# Altium project Capstone PCB.PrjPcb
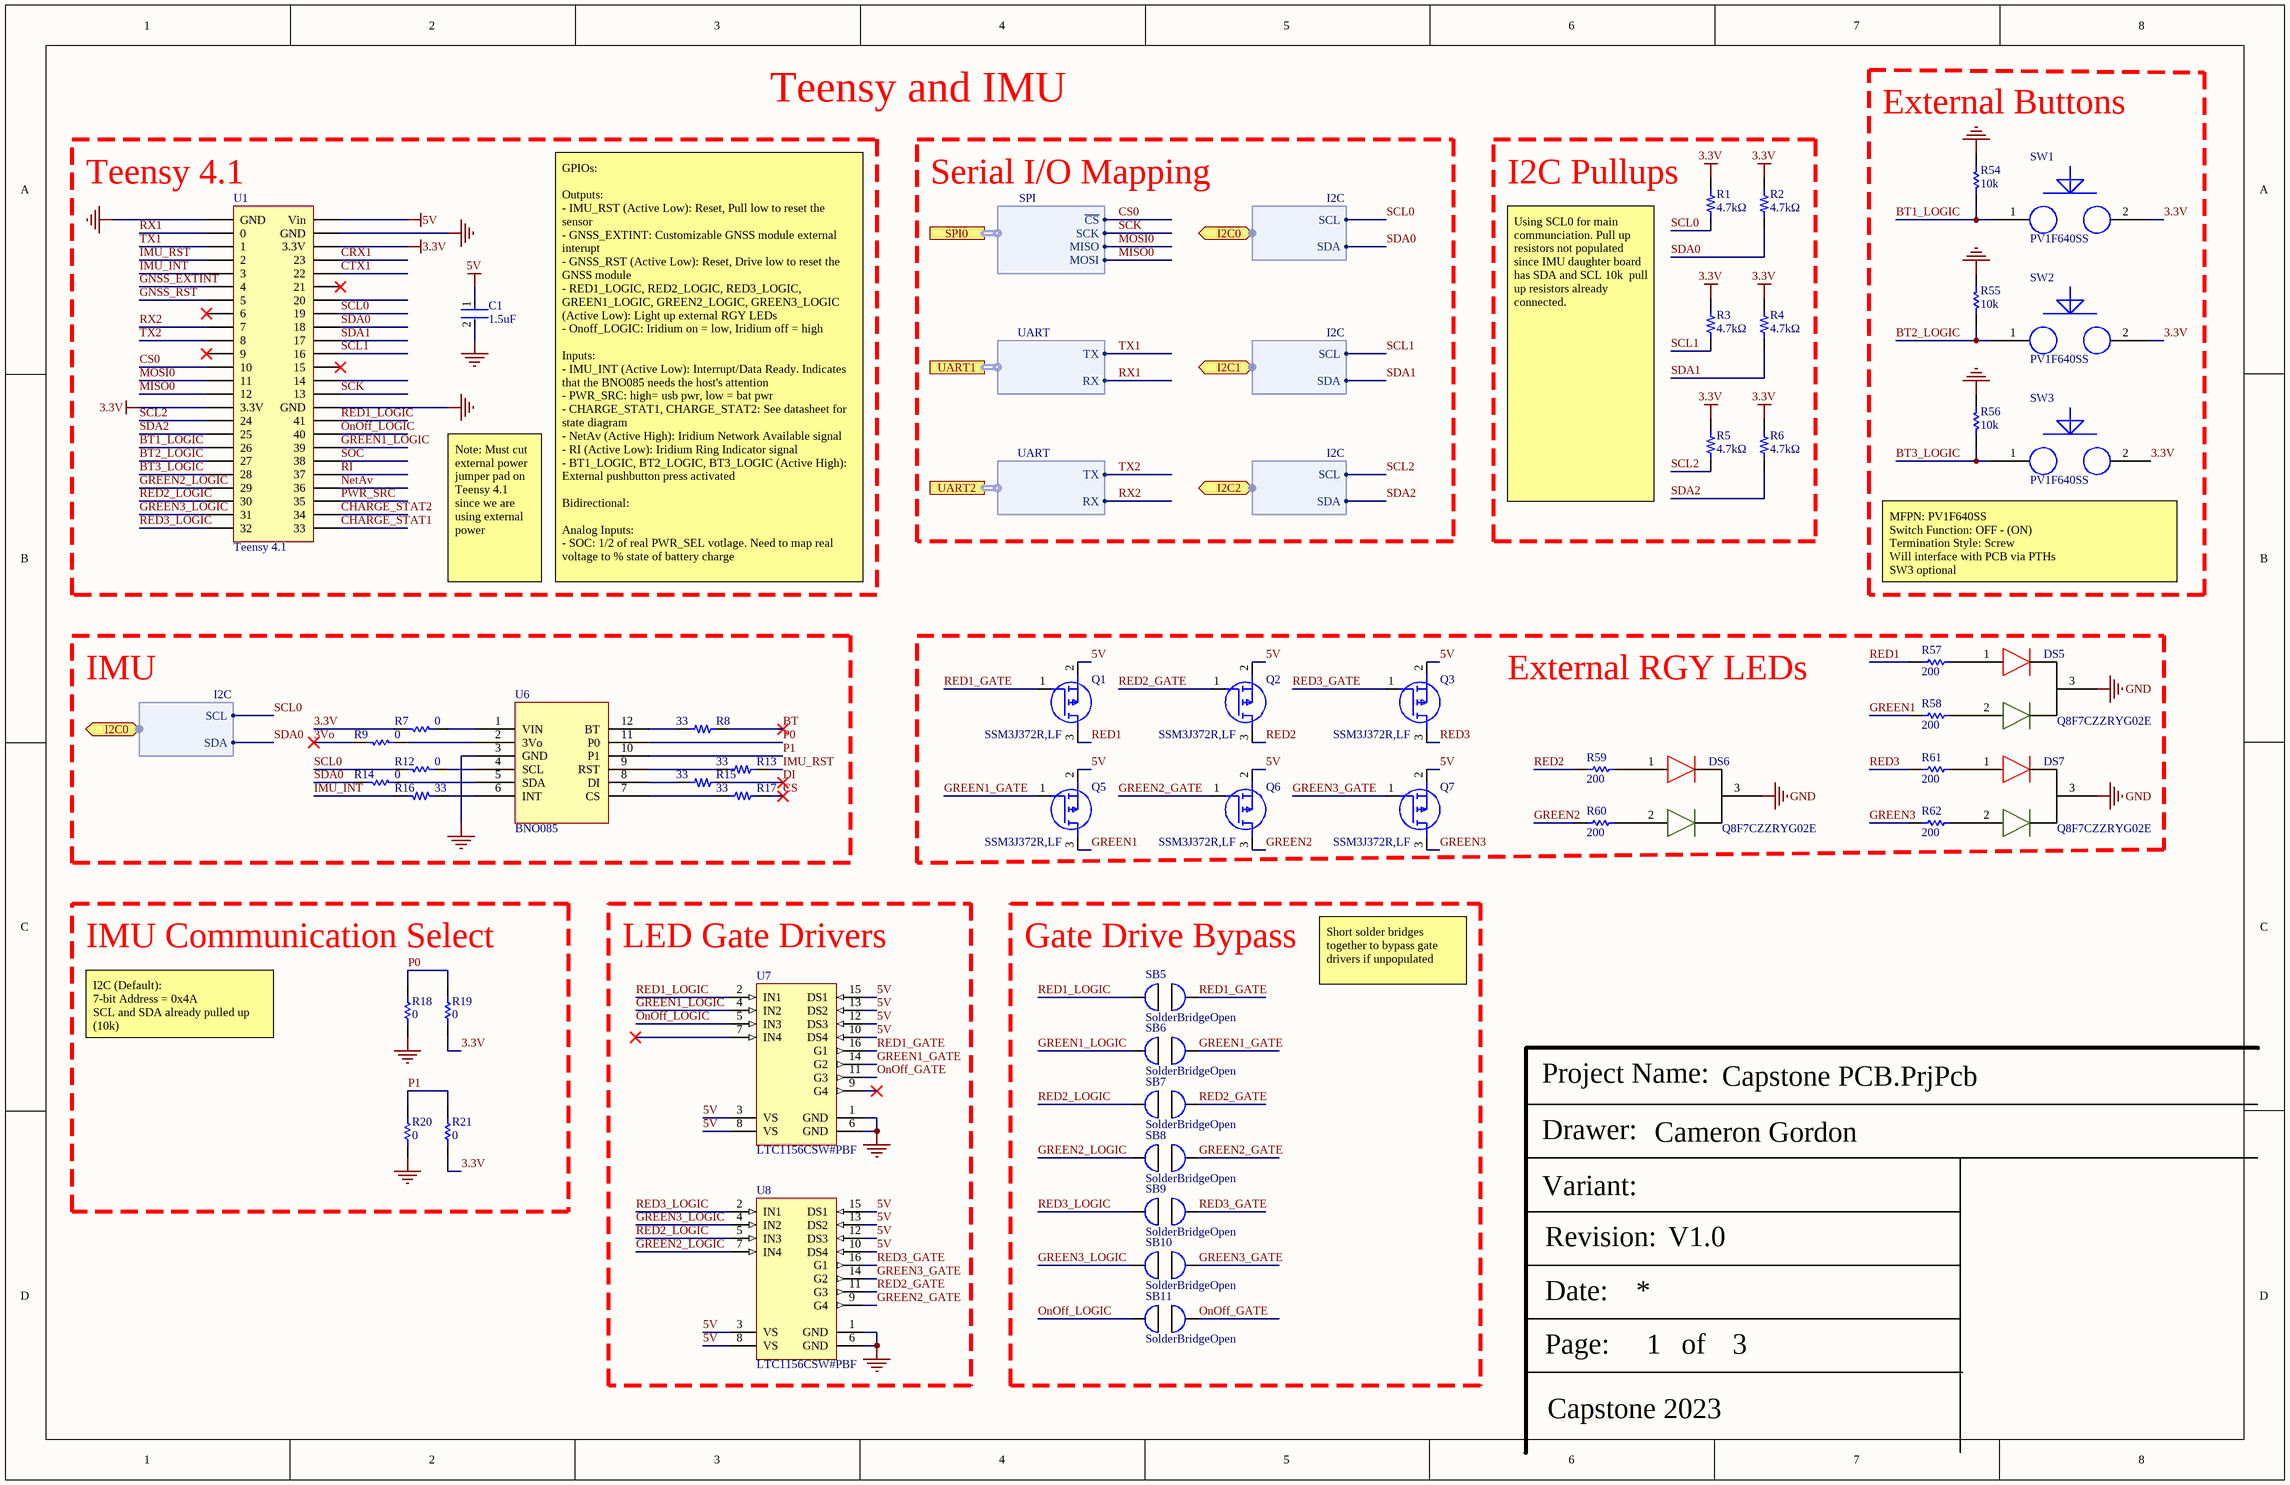
[diagram p0: Teensy and ICs.SchDoc]
ProjectDrawer: Cameron Gordon; ProjectRevision: V1.0
3 sheets, 135 parts. Net scope: global (net labels, ports and power ports of the same name join across sheets).
Board file: Capstone PCB.PcbDoc
Sheets:
  Teensy and ICs.SchDoc
  Power Management.SchDoc
  Communication.SchDoc

## Sheet Teensy and ICs.SchDoc: NER A Size Template
size Tabloid; ApprovedBy: WS; DrawnBy: Cameron Gordon; Address4: X.X.X; Revision: 1; SheetNumber: 1; SheetTotal: 3

### Parts
C1  Capacitance: 1.5uF  [FP-C2012-125-0_2-MFG]  (hidden comment: C2012X7R1E155K125AC)
DS5  Q8F7CZZRYG02E  [Q8F7CZZRYG02E]
DS6  Q8F7CZZRYG02E  [Q8F7CZZRYG02E]
DS7  Q8F7CZZRYG02E  [Q8F7CZZRYG02E]
Q1  SSM3J372R,LF  [SSM3J372RLF]
Q2  SSM3J372R,LF  [SSM3J372RLF]
Q3  SSM3J372R,LF  [SSM3J372RLF]
Q5  SSM3J372R,LF  [SSM3J372RLF]
Q6  SSM3J372R,LF  [SSM3J372RLF]
Q7  SSM3J372R,LF  [SSM3J372RLF]
R1  Resistance: 4.7kΩ  [0603 Resistor]  (hidden comment: ERJ-3GEYJ472V)
R2  Resistance: 4.7kΩ  [0603 Resistor]  (hidden comment: ERJ-3GEYJ472V)
R3  Resistance: 4.7kΩ  [0603 Resistor]  (hidden comment: ERJ-3GEYJ472V)
R4  Resistance: 4.7kΩ  [0603 Resistor]  (hidden comment: ERJ-3GEYJ472V)
R5  Resistance: 4.7kΩ  [0603 Resistor]  (hidden comment: ERJ-3GEYJ472V)
R6  Resistance: 4.7kΩ  [0603 Resistor]  (hidden comment: ERJ-3GEYJ472V)
R7  Resistance: 0  [RESC1608X55X25ML10T15]  (hidden comment: RC0603JR-070RL)
R8  Resistance: 33  [0603 Resistor]  (hidden comment: CRGCQ0603J33R)
R9  Resistance: 0  [RESC1608X55X25ML10T15]  (hidden comment: RC0603JR-070RL)
R12  Resistance: 0  [RESC1608X55X25ML10T15]  (hidden comment: RC0603JR-070RL)
R13  Resistance: 33  [0603 Resistor]  (hidden comment: CRGCQ0603J33R)
R14  Resistance: 0  [RESC1608X55X25ML10T15]  (hidden comment: RC0603JR-070RL)
R15  Resistance: 33  [0603 Resistor]  (hidden comment: CRGCQ0603J33R)
R16  Resistance: 33  [0603 Resistor]  (hidden comment: CRGCQ0603J33R)
R17  Resistance: 33  [0603 Resistor]  (hidden comment: CRGCQ0603J33R)
R18  Resistance: 0  [RESC1608X55X25ML10T15]  (hidden comment: RC0603JR-070RL)
R19  Resistance: 0  [RESC1608X55X25ML10T15]  (hidden comment: RC0603JR-070RL)
R20  Resistance: 0  [RESC1608X55X25ML10T15]  (hidden comment: RC0603JR-070RL)
R21  Resistance: 0  [RESC1608X55X25ML10T15]  (hidden comment: RC0603JR-070RL)
R54  Resistance: 10k  [RESC1609X55X30LL15T15]  (hidden comment: ERJ3EKF1002V)
R55  Resistance: 10k  [RESC1609X55X30LL15T15]  (hidden comment: ERJ3EKF1002V)
R56  Resistance: 10k  [RESC1609X55X30LL15T15]  (hidden comment: ERJ3EKF1002V)
R57  value 200  [RESC2013X60X35ML10T20]  (hidden comment: RC0805JR-07200RL)
R58  value 200  [RESC2013X60X35ML10T20]  (hidden comment: RC0805JR-07200RL)
R59  value 200  [RESC2013X60X35ML10T20]  (hidden comment: RC0805JR-07200RL)
R60  value 200  [RESC2013X60X35ML10T20]  (hidden comment: RC0805JR-07200RL)
R61  value 200  [RESC2013X60X35ML10T20]  (hidden comment: RC0805JR-07200RL)
R62  value 200  [RESC2013X60X35ML10T20]  (hidden comment: RC0805JR-07200RL)
SB5  SolderBridgeOpen  [SOLDERBRIDGEOPEN]
SB6  SolderBridgeOpen  [SOLDERBRIDGEOPEN]
SB7  SolderBridgeOpen  [SOLDERBRIDGEOPEN]
SB8  SolderBridgeOpen  [SOLDERBRIDGEOPEN]
SB9  SolderBridgeOpen  [SOLDERBRIDGEOPEN]
SB10  SolderBridgeOpen  [SOLDERBRIDGEOPEN]
SB11  SolderBridgeOpen  [SOLDERBRIDGEOPEN]
SW1  PV1F640SS  [PV1F640SS-Footprint-1]
SW2  PV1F640SS  [PV1F640SS-Footprint-1]
SW3  PV1F640SS  [PV1F640SS-Footprint-1]
U1  Teensy 4.1  [Teensy_4.1]
U6  BNO085  [BNO085]
U7  LTC1156CSW#PBF  [LT-SW-16_L]
U8  LTC1156CSW#PBF  [LT-SW-16_L]

### Blocks framed on the sheet
External Buttons: R54-R56 SW1-SW3
Teensy 4.1: C1 U1
I2C Pullups: R1-R6
IMU: R7-R9 R12-R17 U6
External RGY LEDs: DS5-DS7 Q1-Q3 Q5-Q7 R57-R62
IMU Communication Select: R18-R21
LED Gate Drivers: U7 U8
Gate Drive Bypass: SB5-SB11

### Ports
I2C0 (bidir, harness I2C), I2C1 (bidir, harness I2C), I2C2 (bidir, harness I2C), SPI0 (harness SPI), UART1 (harness UART), UART2 (harness UART)

### Harnesses
SPI: MOSI, MISO, ~{CS}, SCK
UART: TX, RX
I2C: SCL, SDA

### Nets
3.3V: R1.2 R2.2 R3.2 R4.2 R5.2 R6.2 R7.1 R19.1 R21.1 SW1.2 SW2.2 SW3.2 U1.15(3.3V) U1.46(3.3V)
5V: C1.1 Q1.2(S) Q2.2(S) Q3.2(S) Q5.2(S) Q6.2(S) Q7.2(S) U1.48(Vin) U7.3(VS) U7.8(VS) U7.10(DS4) U7.12(DS3) U7.13(DS2) U7.15(DS1) U8.3(VS) U8.8(VS) U8.10(DS4) U8.12(DS3) U8.13(DS2) U8.15(DS1)
GND: C1.2 DS5.3 DS6.3 DS7.3 R18.1 R20.1 R54.1 R55.1 R56.1 U1.1(GND) U1.34(GND) U1.47(GND) U6.3(GND) U7.1(GND) U7.6(GND) U8.1(GND) U8.6(GND)
3Vo: R9.1
BT: R8.2
BT1_LOGIC: R54.2 SW1.1 U1.18(26)
BT2_LOGIC: R55.2 SW2.1 U1.19(27)
BT3_LOGIC: R56.2 SW3.1 U1.20(28)
CHARGE_STAT1: U1.25(33)
CHARGE_STAT2: U1.26(34)
CRX1: U1.45(23)
CS: R17.2
CS0: U1.12(10) ; port SPI0.~{CS}
CTX1: U1.44(22)
DI: R15.2
GNSS_EXTINT: U1.6(4)
GNSS_RST: U1.7(5)
GREEN1: Q5.3(D) R58.2
GREEN1_GATE: Q5.1(G) SB6.1 U7.14(G2)
GREEN1_LOGIC: SB6.2 U1.31(39) U7.4(IN2)
GREEN2: Q6.3(D) R60.2
GREEN2_GATE: Q6.1(G) SB8.1 U8.9(G4)
GREEN2_LOGIC: SB8.2 U1.21(29) U8.7(IN4)
GREEN3: Q7.3(D) R62.2
GREEN3_GATE: Q7.1(G) SB10.1 U8.14(G2)
GREEN3_LOGIC: SB10.2 U1.23(31) U8.4(IN2)
IMU_INT: R16.2 U1.5(3)
IMU_RST: R13.2 U1.4(2)
MISO0: U1.14(12) ; port SPI0.MOSI
MOSI0: U1.13(11) ; port SPI0.MISO
NetAv: U1.28(36)
OnOff_GATE: SB11.1 U7.11(G3)
OnOff_LOGIC: SB11.2 U1.32(40) U7.5(IN3)
P0: R18.2 R19.2 U6.11(P0)
P1: R20.2 R21.2 U6.10(P1)
PWR_SRC: U1.27(35)
RED1: Q1.3(D) R57.2
RED1_GATE: Q1.1(G) SB5.1 U7.16(G1)
RED1_LOGIC: SB5.2 U1.33(41) U7.2(IN1)
RED2: Q2.3(D) R59.2
RED2_GATE: Q2.1(G) SB7.1 U8.11(G3)
RED2_LOGIC: SB7.2 U1.22(30) U8.5(IN3)
RED3: Q3.3(D) R61.2
RED3_GATE: Q3.1(G) SB9.1 U8.16(G1)
RED3_LOGIC: SB9.2 U1.24(32) U8.2(IN1)
RI: U1.29(37)
RX1: U1.2(0) ; port UART1.RX
RX2: U1.9(7) ; port UART2.RX
SCK: U1.35(13) ; port SPI0.SCK
SCL0: R1.1 R12.1 U1.41(19) ; port I2C0.SCL
SCL1: R3.1 U1.38(16) ; port I2C1.SCL
SCL2: R5.1 U1.16(24) ; port I2C2.SCL
SDA0: R2.1 R14.1 U1.40(18) ; port I2C0.SDA
SDA1: R4.1 U1.39(17) ; port I2C1.SDA
SDA2: R6.1 U1.17(25) ; port I2C2.SDA
SOC: U1.30(38)
TX1: U1.3(1) ; port UART1.TX
TX2: U1.10(8) ; port UART2.TX
NetDS5_1: DS5.1 R57.1
NetDS5_2: DS5.2 R58.1
NetDS6_1: DS6.1 R59.1
NetDS6_2: DS6.2 R60.1
NetDS7_1: DS7.1 R61.1
NetDS7_2: DS7.2 R62.1
NetR7_2: R7.2 U6.1(VIN)
NetR8_1: R8.1 U6.12(BT)
NetR9_2: R9.2 U6.2(3Vo)
NetR12_2: R12.2 U6.4(SCL)
NetR13_1: R13.1 U6.9(RST)
NetR14_2: R14.2 U6.5(SDA)
NetR15_1: R15.1 U6.8(DI)
NetR16_1: R16.1 U6.6(INT)
NetR17_1: R17.1 U6.7(CS)

Not connected (* = marked no-connect by the designer): U1 8(6)* 11(9)* 36(14) 37(15)* 42(20) 43(21)*; U7 7(IN4)* 9(G4)*

### Notes on the sheet
- Teensy and IMU
- Serial I/O Mapping
- Using SCL0 for main communciation. Pull up resistors not populated since IMU daughter board has SDA and SCL 10k  pull up resistors already connected.
- Note: Must cut external power jumper pad on Teensy 4.1 since we are using external power
- GPIOs:
  Outputs:
  - IMU_RST (Active Low): Reset, Pull low to reset the sensor
  - GNSS_EXTINT: Customizable GNSS module external interupt
  - GNSS_RST (Active Low): Reset, Drive low to reset the GNSS module
  - RED1_LOGIC, RED2_LOGIC, RED3_LOGIC, GREEN1_LOGIC, GREEN2_LOGIC, GREEN3_LOGIC (Active Low): Light up external RGY LEDs
  - Onoff_LOGIC: Iridium on = low, Iridium off = high
  Inputs:
  - IMU_INT (Active Low): Interrupt/Data Ready. Indicates that the BNO085 needs the host's attention
  - PWR_SRC: high= usb pwr, low = bat pwr
  - CHARGE_STAT1, CHARGE_STAT2: See datasheet for state diagram
  - NetAv (Active High): Iridium Network Available signal
  - RI (Active Low): Iridium Ring Indicator signal
  - BT1_LOGIC, BT2_LOGIC, BT3_LOGIC (Active High): External pushbutton press activated
  Bidirectional:
  Analog Inputs:
  - SOC: 1/2 of real PWR_SEL votlage. Need to map real voltage to % state of battery charge
- (near SW3) MFPN: PV1F640SS
  Switch Function: OFF - (ON)
  Termination Style: Screw
  Will interface with PCB via PTHs
  SW3 optional
- I2C (Default):
  7-bit Address = 0x4A
  SCL and SDA already pulled up (10k)
- Short solder bridges together to bypass gate drivers if unpopulated
- Project Name:
- Drawer:
- Variant:
- Revision:
- Date:
- Page:
- of
- Capstone 2023

### Library data of the parts
C1 = CMP-08246-004820-1: Multilayer Ceramic Capacitors 1.5μF ±10% 25V X7R SMD 0805; Case Code (Imperial): 0805; Min Operating Temperature: -55°C; Termination: SMD/SMT; Dielectric Material: Ceramic; Weight: 0.000194oz; Height: 1.25mm; Width: 0.049inch; Dielectric: X7R; Voltage Rating: 25V; Max Operating Temperature: 125°C; Mount: Surface Mount; Tolerance: 10%; Length: 0.079inch; Voltage Rating (DC): 25V; Case Code (Metric): 2012; Resistor Type: Ceramic; Thickness: 0.057inch; RoHS Compliant: Yes; Case/Package: 0805; Lead Free: Lead Free; Package Quantity: 1; Packaging: Tape and Reel
Q1-Q3 Q5-Q7 = SSM3J372R,LF: MOSFET (P-Channel); Manufacturer_Name: Toshiba; Datasheet Link: https://toshiba.semicon-storage.com/ap-en/semiconductor/product/mosfets/detail.SSM3J372R.html; Height: 0.88mm; Manufacturer_Part_Number: SSM3J372R,LF; Mouser Part Number: 757-SSM3J372RLF; Mouser Price/Stock: https://www.mouser.co.uk/ProductDetail/Toshiba/SSM3J372RLF?qs=u16ybLDytRbJaSMlwq9MLA%3D%3D; Arrow Part Number: SSM3J372R,LF; Arrow Price/Stock: https://www.arrow.com/en/products/ssm3j372rlf/toshiba?region=nac
R1-R6 = CMP-001-0036-2: 0603 Resistor, 4.7kΩ, ±5%, 0.1W; Power Rating: 100mW; Tolerance: 5%; Package: 0603
R7 R9 R12 R14 R18-R21 = CMP-2100-03667-1: Chip Resistor, 0 Ohm, +/- 5%, 0.1 W, -55 to 155 degC, 0603 (1608 Metric), RoHS, Tape and Reel; Manufacturer: Yageo; Temperature Coefficient: 200ppm/degreesC; Voltage Rating: 50V; Power Rating: 100mW; Width: 0.8mm; Max Operating Temperature: 155degC; Tolerance: 5%; Package Reference: 0603; Height: 0.45mm; Depth: 0.8mm; Package Description: 2-Pin Surface Mount Device, Body 1.6 x 0.8 mm; Termination: SMD/SMT; Package Quantity: 5000; Case/Package: 0603; Case Code (Imperial): 0603; Radiation Hardening: No; Number of Pins: 2; Length: 1.6mm; Lead Free: LeadFree; Voltage Rating (DC): 50V; Military Standard: Not; Datasheet URL: http://www.yageo.com/NewPortal/yageodocoutput?fileName=/pdf/R-Chip/PYu-RC_Group_51_RoHS_L_5.pdf; Manufacturer URL: http://www.yageo.com/; Packaging: TapeandReel; Case Code (Metric): 1608; Min Operating Temperature: -55degC; Composition: ThickFilm; RoHSCompliant: true; Contact Plating: Tin; Datasheet Version: Rev. 5, 10/2016; REACH SVHC: NoSVHC
R8 R13 R15-R17 = CMP-00148-2: Res Thick Film 0603 33 Ohm 5% 0.1W(1/10W) ±200ppm/C Pad SMD Automotive T/R; Power Rating: 100mW; Package: 0603; Tolerance: 5%
R54-R56 = CMP-1012-00623-3: Chip Resistor, 10 KOhm, +/- 1%, 0.1 W, -55 to 155 degC, 0603 (1608 Metric), RoHS, Tape and Reel; Manufacturer: Panasonic; Voltage Rating: 75V; Case\/Package: 0603; Power Rating: 100mW; Temperature Coefficient: 100ppm\/degreesC; Number of Pins: 2; Package Reference: 603; Depth: 0.8mm; Mount: SurfaceMount; Package Description: 2-Pin Surface Mount Device, Body 1.6 x 0.85 mm; Datasheet Version: 02/2017; Length: 1.6mm; Lead Free: LeadFree; Height: 0.45mm; Number of Terminations: 2; Max Power Dissipation: 100mW; Min Operating Temperature: -55degC; Datasheet URL: https://industrial.panasonic.com/cdbs/www-data/pdf/RDA0000/AOA0000C304.pdf; Termination: SMD/SMT; Case Code (Metric): 1608; Case Code (Imperial): 0603; Tolerance: 1%; Max Operating Temperature: 155degC; RoHSCompliant: true; Voltage Rating (DC): 75V; Radiation Hardening: No; Packaging: TapeandReel; Composition: ThickFilm; Mounting Technology: SurfaceMount; Manufacturer URL: http://www.panasonic.com/; Width: 0.031inch; REACH SVHC: NoSVHC; Contact Plating: Tin; Military Standard: Not; Package Quantity: 1
R57-R62 = CMP-2001-01354-1: Manufacturer: Yageo; Part Number: RC0805JR-07200RL
SW1-SW3 = CMP-011-00013-1: Pushbutton Switch; Voltage Rating: 48V; Current Rating: 2A; Movement Type: Momentary, push button, slide, toggle, etc; Throw Configuration: DPST, SPST, etc
U1 = CMP-00040-2: Teensy 4.1 w/ Headers
U6 = BNO085: Adafruit 9-DOF Orientation IMU Fusion Breakout - BNO085
U7 U8 = CMP-0479-00627-1: Quad High Side Micropower MOSFET Driver with Internal Charge Pump, 22 V Vin MAX, 16-pin SOIC (SW-16), 0 to 70 degC, Pb-Free; Manufacturer: Linear Technology; DatasheetVersion: Rev. A; RoHS: TRUE; ComponentLink1URL: http://www.linear.com/; ComponentLink3URL: http://www.linear.com/docs/en/packaging/SO_16_05-08-1620.pdf; PackageDescription: 16-Pin Plastic Small Outline, Body 10.30 x 7.49 mm, Pitch 1.27 mm; Mounting Technology: Surface Mount; ComponentLink3Description: Package Specification; PackageReference: SW-16; ComponentLink2Description: Datasheet; PartNumber: LTC1156CSW#PBF; ComponentLink2URL: http://cds.linear.com/docs/en/datasheet/lt1156.pdf; PackageVersion: Jun-10; ComponentLink1Description: Manufacturer URL

## Sheet Power Management.SchDoc: NER A Size Template
size Tabloid; ApprovedBy: WS; DrawnBy: Cameron Gordon; Address4: X.X.X; Revision: 1; SheetNumber: 2; SheetTotal: 3
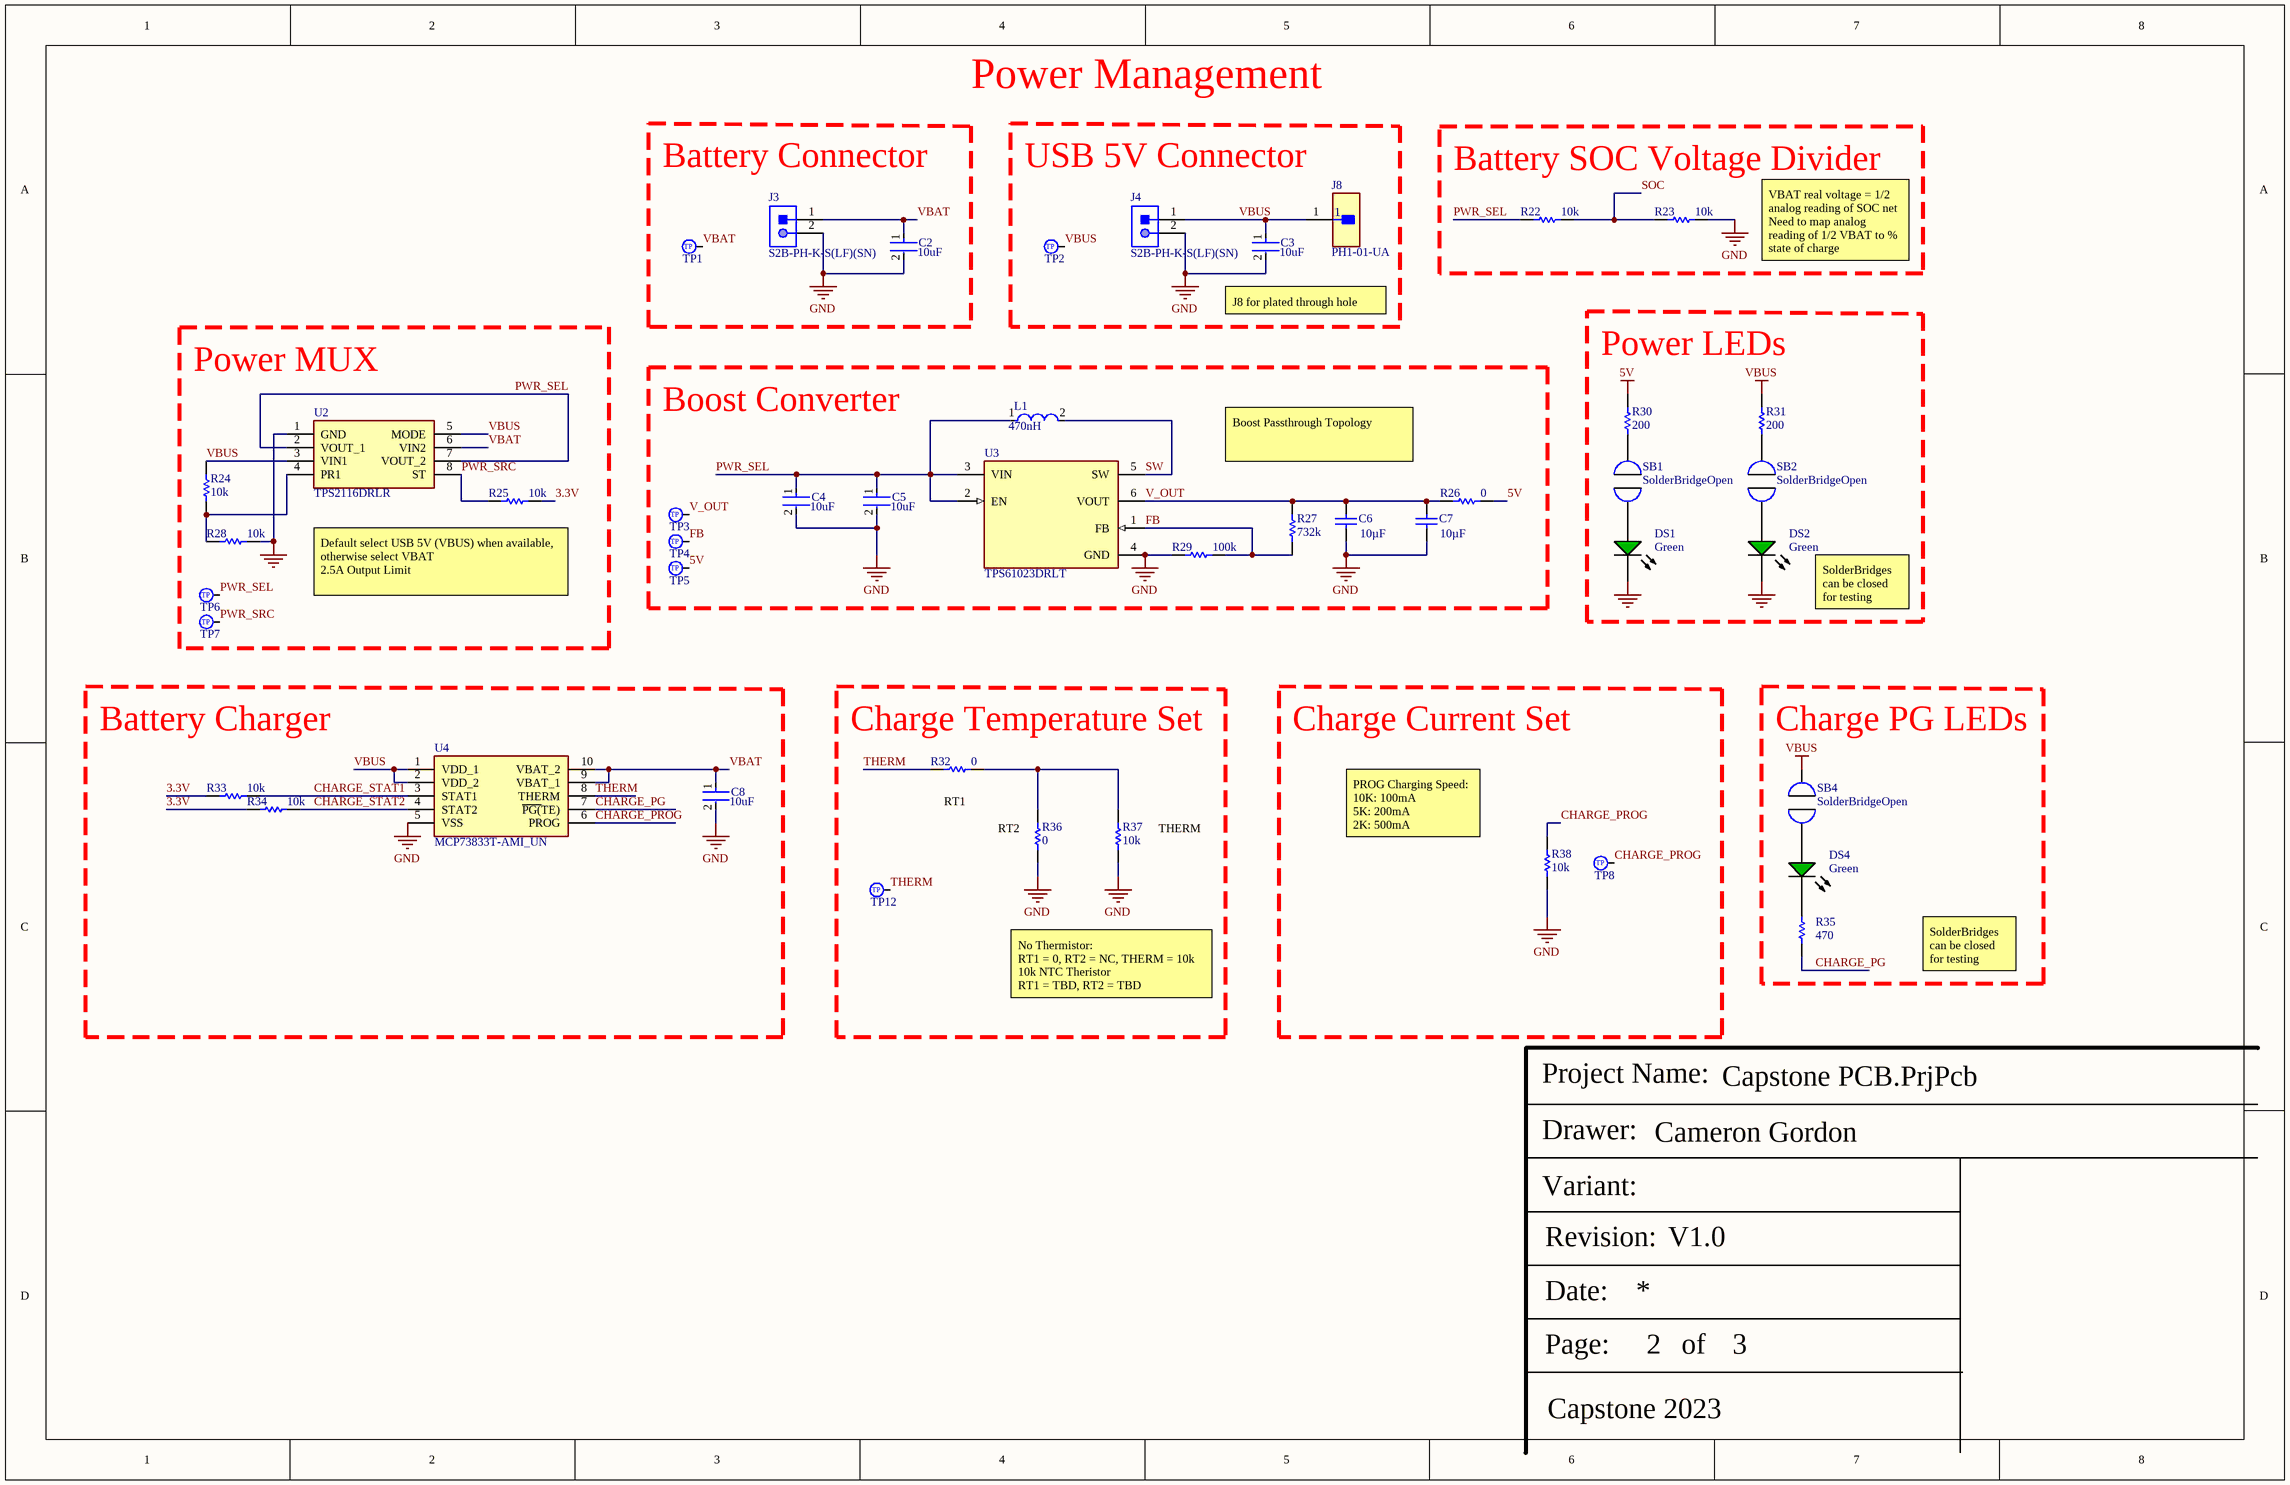
[diagram p1: Power Management.SchDoc]

### Parts
(Parts that share a designator on the sheet are numbered #1, #2 ... from top to bottom, then left to right.)
C2  value 10uF  [FP-C0805C-DG-MFG]  (hidden comment: C0805C106K8PACTU)
C3  value 10uF  [FP-C0805C-DG-MFG]  (hidden comment: C0805C106K8PACTU)
C4  value 10uF  [FP-C0805C-DG-MFG]  (hidden comment: C0805C106K8PACTU)
C5  value 10uF  [FP-C0805C-DG-MFG]  (hidden comment: C0805C106K8PACTU)
C6  Capacitance: 10µF  [CAPC3216X180X55LL20T25]  (hidden comment: GRM31CR71C106KAC7L)
C7  Capacitance: 10µF  [CAPC3216X180X55LL20T25]  (hidden comment: GRM31CR71C106KAC7L)
C8  value 10uF  [FP-C0805C-DG-MFG]  (hidden comment: C0805C106K8PACTU)
DS1  Color: Green  [LUMX-SML-LXT0805_V]  (hidden comment: SML-LXT0805GW-TR)
DS2  Color: Green  [LUMX-SML-LXT0805_V]  (hidden comment: SML-LXT0805GW-TR)
DS4  Color: Green  [LUMX-SML-LXT0805_V]  (hidden comment: SML-LXT0805GW-TR)
J3  S2B-PH-K-S(LF)(SN)  [JST-S2B-PH-K-S_V]
J4  S2B-PH-K-S(LF)(SN)  [JST-S2B-PH-K-S_V]
J8#1  PH1-01-UA  [FP-PH1-01-UA-MFG]
L1  Inductance: 470nH  [FP-IHLP-1212AE-11-MFG]  (hidden comment: IHLP1212AEERR47M11)
R22  Resistance: 10k  [RESC1609X55X30LL15T15]  (hidden comment: ERJ3EKF1002V)
R23  Resistance: 10k  [RESC1609X55X30LL15T15]  (hidden comment: ERJ3EKF1002V)
R24  Resistance: 10k  [RESC1609X55X30LL15T15]  (hidden comment: ERJ3EKF1002V)
R25  Resistance: 10k  [RESC1609X55X30LL15T15]  (hidden comment: ERJ3EKF1002V)
R26  Resistance: 0  [RESC1608X55X25ML10T15]  (hidden comment: RC0603JR-070RL)
R27  value 732k  [RESC1608X55X30LL15T15]  (hidden comment: ERJ-3EKF5232V)
R28  Resistance: 10k  [RESC1609X55X30LL15T15]  (hidden comment: ERJ3EKF1002V)
R29  value 100k  [RESC1608X55X30ML15T15]  (hidden comment: ERJ-3EKF1003V)
R30  value 200  [RESC2013X60X35ML10T20]  (hidden comment: RC0805JR-07200RL)
R31  value 200  [RESC2013X60X35ML10T20]  (hidden comment: RC0805JR-07200RL)
R32  Resistance: 0  [RESC1608X55X25ML10T15]  (hidden comment: RC0603JR-070RL)
R33  Resistance: 10k  [RESC1609X55X30LL15T15]  (hidden comment: ERJ3EKF1002V)
R34  Resistance: 10k  [RESC1609X55X30LL15T15]  (hidden comment: ERJ3EKF1002V)
R35  value 470  [RESC1608X55X30NL15T15]  (hidden comment: ERJ-3GEYJ471V)
R36  Resistance: 0  [RESC1608X55X25ML10T15]  (hidden comment: RC0603JR-070RL)
R37  Resistance: 10k  [RESC1609X55X30LL15T15]  (hidden comment: ERJ3EKF1002V)
R38  Resistance: 10k  [RESC1609X55X30LL15T15]  (hidden comment: ERJ3EKF1002V)
SB1  SolderBridgeOpen  [SOLDERBRIDGEOPEN]
SB2  SolderBridgeOpen  [SOLDERBRIDGEOPEN]
SB4  SolderBridgeOpen  [SOLDERBRIDGEOPEN]
TP1  0.040" Circular Test Point  [40 mil Circular Test Point]  (value not drawn)
TP2  0.040" Circular Test Point  [40 mil Circular Test Point]  (value not drawn)
TP3  0.040" Circular Test Point  [40 mil Circular Test Point]  (value not drawn)
TP4  0.040" Circular Test Point  [40 mil Circular Test Point]  (value not drawn)
TP5  0.040" Circular Test Point  [40 mil Circular Test Point]  (value not drawn)
TP6  0.040" Circular Test Point  [40 mil Circular Test Point]  (value not drawn)
TP7  0.040" Circular Test Point  [40 mil Circular Test Point]  (value not drawn)
TP8  0.040" Circular Test Point  [40 mil Circular Test Point]  (value not drawn)
TP12  0.040" Circular Test Point  [40 mil Circular Test Point]  (value not drawn)
U2  TPS2116DRLR  [SOTFL50P160X60-8N]
U3  TPS61023DRLT  [FP-DRL0006A-MFG]
U4  MCP73833T-AMI_UN  [SOP50P490X110-10N]

### Blocks framed on the sheet
Battery Connector: C2 J3 TP1
USB 5V Connector: C3 J4 J8#1 TP2
Battery SOC Voltage Divider: R22 R23
Power MUX: R24 R25 R28 TP6 TP7 U2
Power LEDs: DS1 DS2 R30 R31 SB1 SB2
Boost Converter: C4-C7 L1 R26 R27 R29 TP3-TP5 U3
Battery Charger: C8 R33 R34 U4
Charge Temperature Set: R32 R36 R37 TP12
Charge Current Set: R38 TP8
Charge PG LEDs: DS4 R35 SB4

### Nets
3.3V: R25.2 R33.1 R34.1
5V: R26.1 R30.2 TP5.1
GND: C2.2 C3.2 C4.2 C5.2 C6.1 C7.1 C8.2 DS1.2(K) DS2.2(K) J3.2 J4.2 R23.2 R28.2 R29.1 R36.2 R37.1 R38.1 U2.1(GND) U3.4(GND) U4.5(VSS)
VBUS: C3.1 J4.1 J8#1.1 R24.2 R31.2 SB4.2 TP2.1 U2.3(VIN1) U2.5(MODE) U4.1(VDD_1) U4.2(VDD_2)
CHARGE_PG: R35.1 U4.7(~{PG(}TE))
CHARGE_PROG: R38.2 TP8.1 U4.6(PROG)
CHARGE_STAT1: R33.2 U4.3(STAT1)
CHARGE_STAT2: R34.2 U4.4(STAT2)
FB: R27.1 R29.2 TP4.1 U3.1(FB)
PWR_SEL: C4.1 C5.1 L1.1 R22.1 TP6.1 U2.2(VOUT_1) U2.7(VOUT_2) U3.2(EN) U3.3(VIN)
PWR_SRC: R25.1 TP7.1 U2.8(ST)
SOC: R22.2 R23.1
SW: L1.2 U3.5(SW)
THERM: R32.2 TP12.1 U4.8(THERM)
V_OUT: C6.2 C7.2 R26.2 R27.2 TP3.1 U3.6(VOUT)
VBAT: C2.1 C8.1 J3.1 TP1.1 U2.6(VIN2) U4.9(VBAT_1) U4.10(VBAT_2)
NetDS1_1: DS1.1(A) SB1.1
NetDS2_1: DS2.1(A) SB2.1
NetDS4_1: DS4.1(A) SB4.1
NetDS4_2: DS4.2(K) R35.2
NetR24_1: R24.1 R28.1 U2.4(PR1)
NetR30_1: R30.1 SB1.2
NetR31_1: R31.1 SB2.2
NetR32_1: R32.1 R36.1 R37.2

### Notes on the sheet
- Power Management
- VBAT real voltage = 1/2 analog reading of SOC net
  Need to map analog reading of 1/2 VBAT to % state of charge
- (near C3) J8 for plated through hole
- Boost Passthrough Topology
- (near R25) Default select USB 5V (VBUS) when available, otherwise select VBAT
  2.5A Output Limit
- SolderBridges can be closed for testing
- (near R32) RT1
- (near R36) RT2
- (near R37) THERM
- PROG Charging Speed:
  10K: 100mA
  5K: 200mA
  2K: 500mA
- No Thermistor:
  RT1 = 0, RT2 = NC, THERM = 10k
  10k NTC Theristor
  RT1 = TBD, RT2 = TBD
- Project Name:
- Drawer:
- Variant:
- Revision:
- Date:
- Page:
- of
- Capstone 2023
- (in symbol CMP-00017-2) TP

### Library data of the parts
C2-C5 C8 = CMP-2007-03243-2: CAP CER 10UF 10V X5R 0805; Manufacturer: Kemet; 3DS Part Number: 220-00001; Tolerance: 10%; Temperature Coefficient: 15%; Material: Ceramic; Device Class L2: Capacitors; Device Class L1: Passive Components; ComponentLink2URL: https://content.kemet.com/datasheets/KEM_C1006_X5R_SMD.pdf; Height: 1.4mm; Lead Free: Yes; Manufacturer Part Number: C0805C106K8PACTU; Digikey Description: CAP CER 10UF 10V X5R 0805; Octopart: https://octopart.com/c0805c106k8pactu-kemet-98697; Capacitance: 10uF; Temperature Range Low: -55°C; Temperature: -55°C to +85°C; Automotive: No; Mouser Description: CAP CER 10UF 10V X5R 0805; Ipc Land Pattern Name: CAPC200125X125; Temperature Range High: +85°C; Voltage: 10V; RoHS: TRUE; Device Class L3: Ceramic Capacitors; ComponentLink2Description: Datasheet; Voltage Rating: 10V; Package: C0805C-DG; Temperature Characteristic: X5R; Category: Cap
C6 C7 = CMP-2000-06352-1: Chip Capacitor, 10 uF, +/- 10%, 16 V, -55 to 125 degC, 1206 (3216 Metric), RoHS, Tape and Reel; Manufacturer: Murata; Other Names: 490-3911-6; Product Training Modules: High-CapMultilayerCeramicCapacitors; Temperature Coefficient: X7R; Catalog Drawings: GRMSeries_1206_1.6; Featured Product: GA3SafetyRecognizedCapsandHi-CapMLCC; Online Catalog: GRMSeries; Voltage - Rated: 16V; Size / Dimension: 0.126"Lx0.063"W(3.20mmx1.60mm); Applications: GeneralPurpose; Package Description: 2-Pin Surface Mount Device, Body 3.2 x 1.6 mm; Datasheet Version: 03/2016; Package Reference: 1206; Manufacturer URL: http://www.murata.com/; Standard Package: 1; Mounting Type: SurfaceMount,MLCC; Thickness (Max): 0.071"(1.80mm); Category: Capacitors; Family: CeramicCapacitors; Lead Spacing: -; Tolerance: ±10%; Packaging: Digi-Reel®; Lead Style: -; Package / Case: 1206(3216Metric); Datasheet URL: http://search.murata.co.jp/Ceramy/image/img/A01X/G101/ENG/GRM31CR71C106KAC7-01.pdf; Operating Temperature: -55°C~125°C; Mounting Technology: SurfaceMount; Series: GRM; Ratings: -; Height - Seated (Max): -; Features: -
DS1 DS2 DS4 = CMP-1724-00001-1: LED, GREEN, 565 nm, 2 V, -25 to 80 degC, 2-Pin SMD, RoHS, Tape and Reel; Case\/Package: 0805; RoHSCompliant: true; REACH SVHC: No SVHC; Packaging: Tape and Reel; ComponentLink2URL: http://www.lumex.com/content/files/ProductAttachment/SML-LXT0805GW-TR.pdf; ComponentLink1URL: http://www.lumexinstruments.com/; Min Operating Temperature: -25 degC; Max Operating Temperature: 85 degC; DatasheetVersion: Rev. F, 09/2009; Case Code (Metric): 2012; Width: 1.25 mm; PackageDescription: 2-Pin Surface Mount Device, Body 2 x 1.25 mm; ComponentLink1Description: Manufacturer URL; Mount: Surface Mount; PackageReference: SML-LXT0805; Length: 2 mm; Case Code (Imperial): 0805; ComponentLink2Description: Datasheet; Package Quantity: 4000; Mounting Technology: Surface Mount
J3 J4 = CMP-1755-00004-1: Male Header, Pitch 2 mm, 1 x 2 Position, Height 4.8 mm, Tail Length 3.4 mm, -25 to 85 degC, RoHS, Bulk; Case\Package: Radial; Tolerance: 20%; Capacitance: 10 uF; Voltage Rating (DC): 50 V; Packaging: Bulk; ComponentLink1URL: http://www.jst-mfg.com/product/pdf/eng/ePH.pdf; Radiation Hardening: No; Height: 11 mm; Package Quantity: 200; PackageDescription: Male Header, Pitch 2 mm, 1 x 2 Position, Height 4.8 mm, Tail Length 3.4 mm; PackageReference: S2B-PH-K-S; Diameter: 5 mm; Pins: 2; Mount: Through Hole; Max Operating Temperature: 85 degC; Min Operating Temperature: -40 degC; ComponentLink1Description: Datasheet; DatasheetVersion: Dec-12; Length: 11 mm; Lead Pitch: 2 mm; REACH SVHC: No SVHC; Voltage Rating: 50 V; RoHSCompliant: true
J8#1 = CMP-42765-000003-1: CONN HEADER VERT 1POS 2.54MM; Number of Positions: 1; Voltage Rating (AC): 250V; Insulation Material: PBT; Number of Rows: 1; Connector Type: Header; Min Operating Temperature: -40°C; Packaging: Bulk; Contact Material: Brass; Mount: Through Hole; Contact Shape: Square; Contact Finish - Mating: GOLD; Series: PH1; Contact Type: Male Pin; Termination: Solder; Flammability Rating: UL94 V-0; Insulation Color: Black; Lead Free: Lead Free; Fastening Type: Pull; Max Operating Temperature: 105°C
L1 = CMP-02424-000856-1: FIXED IND 470NH 6.7A 15 MOHM SMD; Shielding: Shielded; DC Resistance (DCR): 15mR; Test Frequency: 100kHz; Self Resonant Frequency: 1MHz; Core Material: Ferrite; Tolerance: 20%; Depth: 3.2mm; Case/Package: Nonstandard; Packaging: Cut Tape; Number of Pins: 2; Case Code (Imperial): 1212; Height - Seated (Max): 0.059inch; RoHS Compliant: Yes; Height: 1.2mm; Military Standard: Not; Lead Free: Lead Free; Width: 0.118inch; Saturation Current: 6.7A; Radiation Hardening: No; Mount: Surface Mount; Series: IHLP-1212AE-11; Max DC Current: 6.7A; Termination: SMD/SMT; Current Rating: 6.7A; Rated Current-Max: 6.7A; RMS Current (Irms): 6.7A; Inductance Tolerance: 20%; Package Quantity: 3000; Max Operating Temperature: 125°C; Length: 0.144inch; Min Operating Temperature: -55°C
R22-R25 R28 R33 R34 R37 R38 = CMP-1012-00623-3: as R54 on sheet Teensy and ICs; Number of Pins: 2; Package Reference: 603; Depth: 0.8mm; Mount: SurfaceMount; Package Description: 2-Pin Surface Mount Device, Body 1.6 x 0.85 mm; Datasheet Version: 02/2017; Length: 1.6mm; Lead Free: LeadFree; Height: 0.45mm; Number of Terminations: 2; Max Power Dissipation: 100mW; Min Operating Temperature: -55degC; Datasheet URL: https://industrial.panasonic.com/cdbs/www-data/pdf/RDA0000/AOA0000C304.pdf; Termination: SMD/SMT; Case Code (Metric): 1608; Case Code (Imperial): 0603; Tolerance: 1%; Max Operating Temperature: 155degC; RoHSCompliant: true; Voltage Rating (DC): 75V; Radiation Hardening: No; Packaging: TapeandReel; Composition: ThickFilm; Mounting Technology: SurfaceMount; Manufacturer URL: http://www.panasonic.com/; Width: 0.031inch; REACH SVHC: NoSVHC; Contact Plating: Tin; Military Standard: Not; Package Quantity: 1
R26 R32 R36 = CMP-2100-03667-1: as R7 on sheet Teensy and ICs; Width: 0.8mm; Max Operating Temperature: 155degC; Tolerance: 5%; Package Reference: 0603; Height: 0.45mm; Depth: 0.8mm; Package Description: 2-Pin Surface Mount Device, Body 1.6 x 0.8 mm; Termination: SMD/SMT; Package Quantity: 5000; Case/Package: 0603; Case Code (Imperial): 0603; Radiation Hardening: No; Number of Pins: 2; Length: 1.6mm; Lead Free: LeadFree; Voltage Rating (DC): 50V; Military Standard: Not; Datasheet URL: http://www.yageo.com/NewPortal/yageodocoutput?fileName=/pdf/R-Chip/PYu-RC_Group_51_RoHS_L_5.pdf; Manufacturer URL: http://www.yageo.com/; Packaging: TapeandReel; Case Code (Metric): 1608; Min Operating Temperature: -55degC; Composition: ThickFilm; RoHSCompliant: true; Contact Plating: Tin; Datasheet Version: Rev. 5, 10/2016; REACH SVHC: NoSVHC
R27 = CMP-2000-00551-1: Manufacturer: Panasonic; Part Number: ERJ-3EKF5232V
R29 = CMP-2000-00182-1: Manufacturer: Panasonic; Part Number: ERJ-3EKF1003V
R30 R31 = CMP-2001-01354-1: Manufacturer: Yageo; Part Number: RC0805JR-07200RL
R35 = CMP-2000-00795-1: Manufacturer: Panasonic; Part Number: ERJ-3GEYJ471V
TP1-TP8 TP12 = CMP-00017-2
U2 = TPS2116DRLR: Integrated Circuit; Manufacturer_Name: Texas Instruments; Datasheet Link: https://www.ti.com/lit/gpn/tps2116; Height: 0.6mm; Manufacturer_Part_Number: TPS2116DRLR; Mouser Part Number: 595-TPS2116DRLR; Mouser Price/Stock: https://www.mouser.co.uk/ProductDetail/Texas-Instruments/TPS2116DRLR?qs=aP1CjGhiNiGo3XAyXcVPaQ%3D%3D; Arrow Part Number: TPS2116DRLR; Arrow Price/Stock: https://www.arrow.com/en/products/tps2116drlr/texas-instruments?region=nac
U3 = CMP-04918-000657-1: IC REG BOOST ADJ 3A SOT563
U4 = MCP73833T-AMI_UN: Integrated Circuit; Manufacturer_Name: Microchip; Manufacturer_Part_Number: MCP73833T-AMI/UN; Datasheet Link: https://datasheet.datasheetarchive.com/originals/distributors/Datasheets-DGA15/727183.pdf; Height: 1.1mm; Mouser Part Number: 579-MCP73833T-AMI/UN; Mouser Price/Stock: https://www.mouser.co.uk/ProductDetail/Microchip-Technology/MCP73833T-AMI-UN?qs=Fxu3fLyJv8cZVyNfuXhl2Q%3D%3D; Arrow Part Number: MCP73833T-AMI/UN; Arrow Price/Stock: https://www.arrow.com/en/products/mcp73833t-amiun/microchip-technology?region=nac

## Sheet Communication.SchDoc: NER A Size Template
size Tabloid; ApprovedBy: WS; DrawnBy: Cameron Gordon; Address4: X.X.X; Revision: 1; SheetNumber: 3; SheetTotal: 3
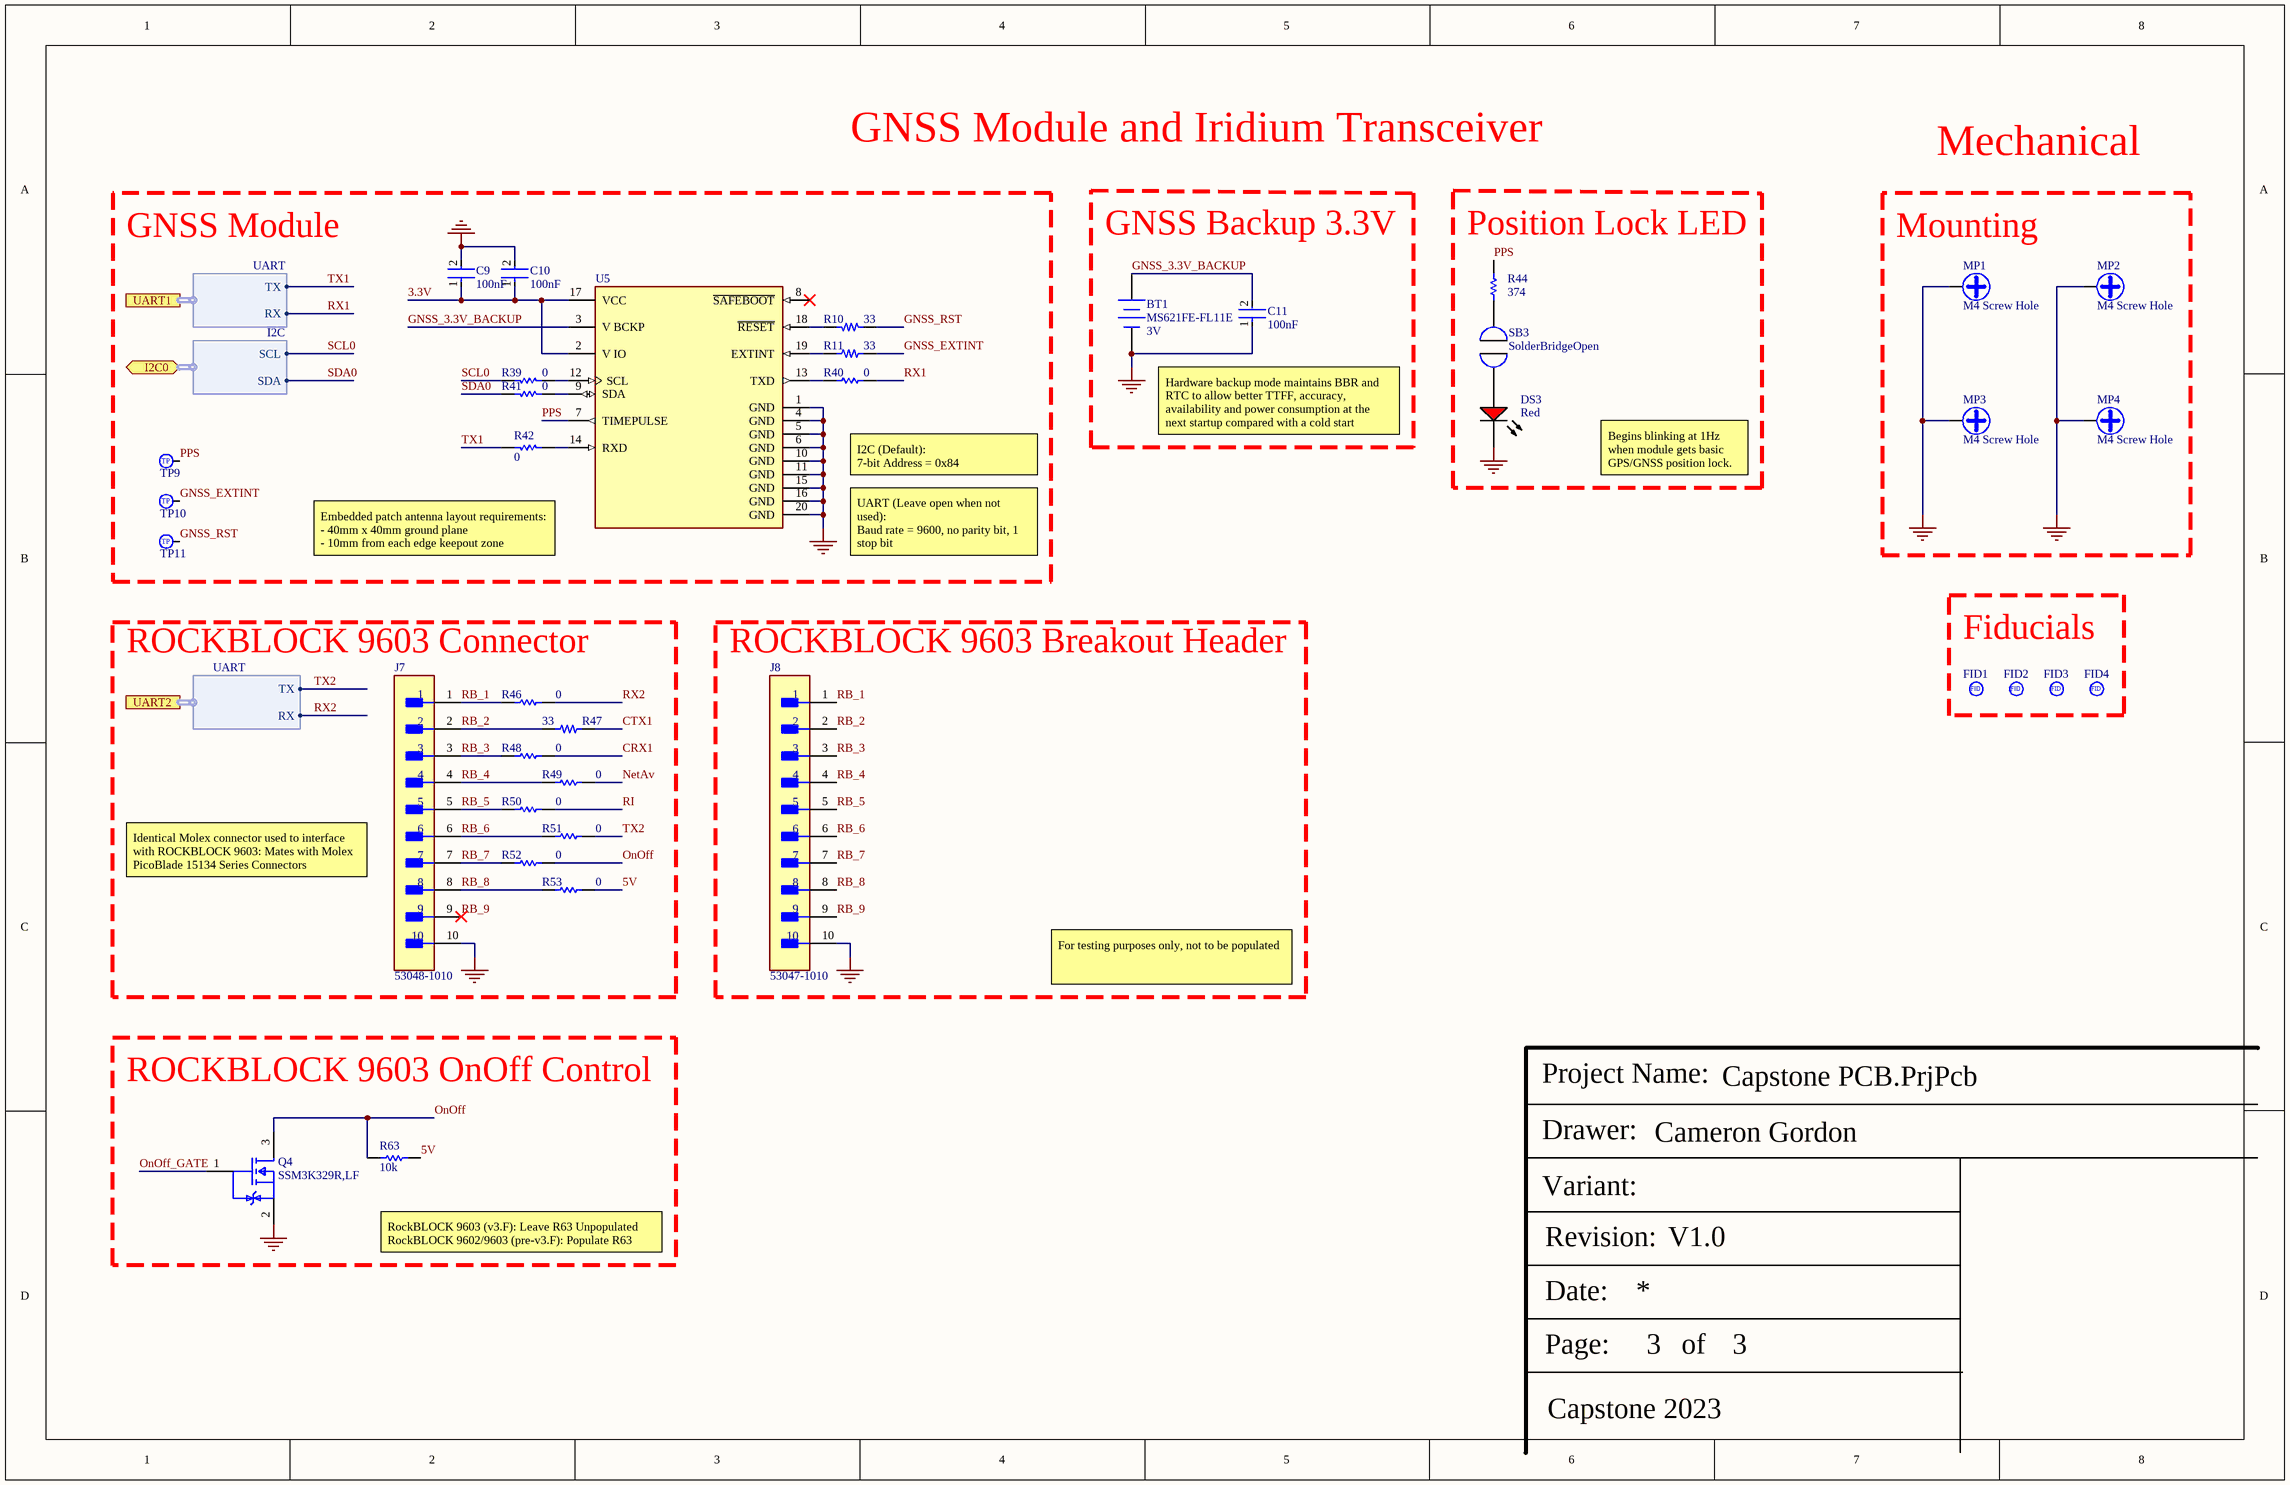
[diagram p2: Communication.SchDoc]

### Parts
(Parts that share a designator on the sheet are numbered #1, #2 ... from top to bottom, then left to right.)
BT1  MS621FE-FL11E  Output Voltage: 3V  [SEIK-MS621FE-FL11E-2_V]
C9  Capacitance: 100nF  [FP-CL10-IPC_C]  (hidden comment: CL10B104MB8NNNC)
C10  Capacitance: 100nF  [FP-CL10-IPC_C]  (hidden comment: CL10B104MB8NNNC)
C11  Capacitance: 100nF  [FP-CL10-IPC_C]  (hidden comment: CL10B104MB8NNNC)
DS3  Illumination Colour: Red  [LTST-C170KRKT_V]  (hidden comment: LTST-C170KRKT)
FID1  Fiducial  [40 mil Circular Test Point]  (value not drawn)
FID2  Fiducial  [40 mil Circular Test Point]  (value not drawn)
FID3  Fiducial  [40 mil Circular Test Point]  (value not drawn)
FID4  Fiducial  [40 mil Circular Test Point]  (value not drawn)
J7  53048-1010  [FP-53048-1010-MFG]
J8#2  53047-1010  [FP-53047-1010-MFG]
MP1  M4 Screw Hole  [New footprint 1]
MP2  M4 Screw Hole  [New footprint 1]
MP3  M4 Screw Hole  [New footprint 1]
MP4  M4 Screw Hole  [New footprint 1]
Q4  SSM3K329R,LF  [FP-2-3Z1A-MFG]
R10  Resistance: 33  [0603 Resistor]  (hidden comment: CRGCQ0603J33R)
R11  Resistance: 33  [0603 Resistor]  (hidden comment: CRGCQ0603J33R)
R39  Resistance: 0  [RESC1608X55X25ML10T15]  (hidden comment: RC0603JR-070RL)
R40  Resistance: 0  [RESC1608X55X25ML10T15]  (hidden comment: RC0603JR-070RL)
R41  Resistance: 0  [RESC1608X55X25ML10T15]  (hidden comment: RC0603JR-070RL)
R42  Resistance: 0  [RESC1608X55X25ML10T15]  (hidden comment: RC0603JR-070RL)
R44  value 374  [RESC2013X60X35ML10T20]  (hidden comment: RC0805FR-07374RL)
R46  Resistance: 0  [RESC1608X55X25ML10T15]  (hidden comment: RC0603JR-070RL)
R47  Resistance: 33  [0603 Resistor]  (hidden comment: CRGCQ0603J33R)
R48  Resistance: 0  [RESC1608X55X25ML10T15]  (hidden comment: RC0603JR-070RL)
R49  Resistance: 0  [RESC1608X55X25ML10T15]  (hidden comment: RC0603JR-070RL)
R50  Resistance: 0  [RESC1608X55X25ML10T15]  (hidden comment: RC0603JR-070RL)
R51  Resistance: 0  [RESC1608X55X25ML10T15]  (hidden comment: RC0603JR-070RL)
R52  Resistance: 0  [RESC1608X55X25ML10T15]  (hidden comment: RC0603JR-070RL)
R53  Resistance: 0  [RESC1608X55X25ML10T15]  (hidden comment: RC0603JR-070RL)
R63  Resistance: 10k  [RESC1609X55X30LL15T15]  (hidden comment: ERJ3EKF1002V)
SB3  SolderBridgeOpen  [SOLDERBRIDGEOPEN]
TP9  0.040" Circular Test Point  [40 mil Circular Test Point]  (value not drawn)
TP10  0.040" Circular Test Point  [40 mil Circular Test Point]  (value not drawn)
TP11  0.040" Circular Test Point  [40 mil Circular Test Point]  (value not drawn)
U5  SAM-M10Q-00B  [FP-SAM-M10Q-00B-MFG]  (value not drawn)

### Blocks framed on the sheet
GNSS Module: C9 C10 R10 R11 R39-R42 TP9-TP11 U5
GNSS Backup 3.3V: BT1 C11
Position Lock LED: DS3 R44 SB3
Mounting: MP1-MP4
ROCKBLOCK 9603 Connector: J7 R46-R53
ROCKBLOCK 9603 Breakout Header: J8#2
Fiducials: FID1-FID4
ROCKBLOCK 9603 OnOff Control: Q4 R63

### Ports
I2C0 (bidir, harness I2C), UART1 (harness UART), UART2 (harness UART)

### Harnesses
UART: TX, RX
I2C: SCL, SDA

### Nets
3.3V: C9.1 C10.1 U5.2(V_IO) U5.17(VCC)
5V: R53.1 R63.1
GND: BT1.2(-) C9.2 C10.2 C11.1 DS3.2(K) J7.10 J8#2.10 MP1.1 MP2.1 MP3.1 MP4.1 Q4.2(SOURCE) U5.1(GND) U5.4(GND) U5.5(GND) U5.6(GND) U5.10(GND) U5.11(GND) U5.15(GND) U5.16(GND) U5.20(GND)
CRX1: R48.1
CTX1: R47.2
GNSS_3.3V_BACKUP: BT1.1(+) C11.2 U5.3(V_BCKP)
GNSS_EXTINT: R11.2 TP10.1
GNSS_RST: R10.1 TP11.1
NetAv: R49.1
OnOff: Q4.3(DRAIN) R52.1 R63.2
OnOff_GATE: Q4.1(GATE)
PPS: R44.1 TP9.1 U5.7(TIMEPULSE)
RB_1: J7.1 J8#2.1 R46.2
RB_2: J7.2 J8#2.2 R47.1
RB_3: J7.3 J8#2.3 R48.2
RB_4: J7.4 J8#2.4 R49.2
RB_5: J7.5 J8#2.5 R50.2
RB_6: J7.6 J8#2.6 R51.2
RB_7: J7.7 J8#2.7 R52.2
RB_8: J7.8 J8#2.8 R53.2
RB_9: J7.9 J8#2.9
RI: R50.1
RX1: R40.1 ; port UART1.RX
RX2: R46.1 ; port UART2.RX
SCL0: R39.1 ; port I2C0.SCL
SDA0: R41.1 ; port I2C0.SDA
TX1: R42.1 ; port UART1.TX
TX2: R51.1 ; port UART2.TX
NetDS3_1: DS3.1(A) SB3.1
NetR10_2: R10.2 U5.18(~{RESET})
NetR11_1: R11.1 U5.19(EXTINT)
NetR39_2: R39.2 U5.12(SCL)
NetR40_2: R40.2 U5.13(TXD)
NetR41_2: R41.2 U5.9(SDA)
NetR42_2: R42.2 U5.14(RXD)
NetR44_2: R44.2 SB3.2

Not connected (* = marked no-connect by the designer): U5 8(~{SAFEBOOT})*

### Notes on the sheet
- GNSS Module and Iridium Transceiver
- Mechanical
- Hardware backup mode maintains BBR and RTC to allow better TTFF, accuracy, availability and power consumption at the next startup compared with a cold start
- I2C (Default):
  7-bit Address = 0x84
- Begins blinking at 1Hz when module gets basic GPS/GNSS position lock.
- Embedded patch antenna layout requirements:
  - 40mm x 40mm ground plane
  - 10mm from each edge keepout zone
- UART (Leave open when not used):
  Baud rate = 9600, no parity bit, 1 stop bit
- Identical Molex connector used to interface with ROCKBLOCK 9603: Mates with Molex PicoBlade 15134 Series Connectors
- For testing purposes only, not to be populated
- RockBLOCK 9603 (v3.F): Leave R63 Unpopulated
  RockBLOCK 9602/9603 (pre-v3.F): Populate R63
- Project Name:
- Drawer:
- Variant:
- Revision:
- Date:
- Page:
- of
- Capstone 2023
- (in symbol CMP-00017-2) TP
- (in symbol CMP-00019-1) FID

### Library data of the parts
BT1 = CMP-2000-05342-1: MS Lihium Rechargeable Battery, 3 V, -20 to 60 degC, Tray; Manufacturer: SeikoInstruments; Brand: SeikoInstrumentsMicroEnergy; Capacity: 5.5mAh; Chemistry: Lithium; Battery Size: 621; Unit Weight: 0.008113oz; Datasheet URL: http://datasheet.octopart.com/MS621FE-FL11E-Seiko-datasheet-5320152.pdf; Rechargeable/Non-Rechargeable: Rechargeable; Orientation: Vertical; Height: 2.1mm; Series: MS; Datasheet Version: Jan-08; Type: CoinCellBatterywithLeads; Diameter: 6.8mm; Mounting Style: WithLeads; Product Category: CoinCellBattery; Termination Style: ThroughHole; Packaging: Tray; Manufacturer URL: http://www.sii.co.jp/en/; RoHS: NotApplicable; Factory Pack Quantity: 100
C9-C11 = CMP-13271-001724-1: Cap Ceramic 100nF 50V X7R ±20% Pad SMD 0603 +125°C T/R; Mount: Surface Mount; Lead Free: Lead Free; Max Operating Temperature: 125°C; Voltage Rating: 50V; Case Code (Imperial): 0603; Height: 0.8mm; Length: 1.6mm; Tolerance: 20%; Case Code (Metric): 1608; Thickness: 0.035inch; Depth: 0.8mm; Width: 0.031inch; Package Quantity: 1; Min Operating Temperature: -55°C; Case/Package: 0603; Radiation Hardening: No; Voltage Rating (DC): 50V; Dielectric: X7R; Packaging: Tape and Reel
DS3 = CMP-2000-07593-1: LED Red, 75 mW, 54 mcd, -55 to 85 degC, 2-Pin SMD, RoHS, Tape and Reel; Manufacturer: Lite-On; Lens Transparency: Clear; Number of Elements: 1; Power Rating: 75mW; Luminous Intensity: 54mcd; Viewing Angle: 130degrees; Forward Current: 30mA; Wavelength: 639nm; Lens Style: Rectangular; Case\/Package: 0805; Test Current: 20mA; Dominant Wavelength: 631nm; Forward Voltage: 2V; Lens Colour: Colorless; Min Operating Temperature: -55degC; RoHSCompliant: True; Length: 3.2mm; Width: 1.25mm; Mount: SurfaceMount; Packaging: TapeandReel; Number of LEDs: 1; Radiation Hardening: No; Datasheet URL: http://optoelectronics.liteon.com/upload/download/DS-22-99-0150/LTST-C170KRKT.pdf; Datasheet Version: Rev. D, 11/2014; Case Code (Metric): 2012; Height: 1.1mm; Number of Pins: 2; Package Description: 2-Pin Surface Mount Device, Body 2 x 1.25 mm; Manufacturer URL: http://www.us.liteon.com/; Lead Free: LeadFree; Colour: Red; Case Code (Imperial): 0805; Max Operating Temperature: 85degC; Power Dissipation: 75mW; Mounting Technology: SurfaceMount; Package Reference: C170KRKT; Package Quantity: 1; Depth: 1.6mm
FID1-FID4 = CMP-00019-1
J7 = CMP-04776-000812-1: CONN HEADER R/A 10POS 1.25MM; Number of Positions: 10; Glow Wire Compliant: Non-compliant; Current Rating: 1A; Voltage Rating (AC): 125V; Contact Resistance: 20mR; Body Plating: Tin; Insulation Resistance: 100MR; Gender: Male; Max Operating Temperature: 85°C; Contact Plating: Tin; Orientation: Right Angle; Housing Color: Natural; Number of Rows: 1; RoHS Compliant: Yes; Number of Contacts: 10; Series: PicoBlade; Package Quantity: 2000; Pitch: 1.25mm; Number of Circuits: 10; Lead Pitch: 1.25mm; Min Operating Temperature: -40°C; Height: 3.5mm; Mount: Through Hole; Voltage Rating (DC): 125V; Voltage Rating: 125V; Packaging: Tray; Radiation Hardening: No; Depth: 5.5mm; Lead Free: Lead Free; Flammability Rating: UL94 V-0; Max Voltage Rating (AC): 125V; Working Voltage: 125V; Termination: Solder; Contact Material: Bronze; Length: 14.25mm; Color: Natural; Number of Poles: 10; Housing Material: Nylon; Max Current Rating: 1A
J8#2 = CMP-002-00108-1: Board Connector, 10 Contact(s), 1 Row(s), Male, Straight, 0.049 inch Pitch, Solder Terminal, Locking, White Insulator, Receptacle; Current Rating: 0A; Gender: Pin; Voltage Rating: 0V; Number of Contacts: 10; Orientation: Vertical; Mounting Type: Through Hole
MP1-MP4 = CMP-00024-1: Plated hole for M4 mounting hardware
Q4 = CMP-35916-000013-1: MOSFET N CH 30V 3.5A 2-3Z1A; Gate to Source Voltage (Vgs): 12V; Input Capacitance: 123pF; Drain to Source Resistance: 290mR; Rds On Max: 126mR; Max Power Dissipation: 1W; Continuous Drain Current (ID): 3.5A; Mount: Surface Mount; Case/Package: SOT-23-3; Drain to Source Breakdown Voltage: 30V; Packaging: Tape and Reel; Drain to Source Voltage (Vdss): 30V; Power Dissipation: 1W; Package Quantity: 3000
R10 R11 R47 = CMP-00148-2: as R8 on sheet Teensy and ICs; Package: 0603; Tolerance: 5%
R39-R42 R46 R48-R53 = CMP-2100-03667-1: as R7 on sheet Teensy and ICs; Width: 0.8mm; Max Operating Temperature: 155degC; Tolerance: 5%; Package Reference: 0603; Height: 0.45mm; Depth: 0.8mm; Package Description: 2-Pin Surface Mount Device, Body 1.6 x 0.8 mm; Termination: SMD/SMT; Package Quantity: 5000; Case/Package: 0603; Case Code (Imperial): 0603; Radiation Hardening: No; Number of Pins: 2; Length: 1.6mm; Lead Free: LeadFree; Voltage Rating (DC): 50V; Military Standard: Not; Datasheet URL: http://www.yageo.com/NewPortal/yageodocoutput?fileName=/pdf/R-Chip/PYu-RC_Group_51_RoHS_L_5.pdf; Manufacturer URL: http://www.yageo.com/; Packaging: TapeandReel; Case Code (Metric): 1608; Min Operating Temperature: -55degC; Composition: ThickFilm; RoHSCompliant: true; Contact Plating: Tin; Datasheet Version: Rev. 5, 10/2016; REACH SVHC: NoSVHC
R44 = CMP-2001-01105-1: Manufacturer: Yageo; Part Number: RC0805FR-07374RL
R63 = CMP-1012-00623-3: as R54 on sheet Teensy and ICs; Number of Pins: 2; Package Reference: 603; Depth: 0.8mm; Mount: SurfaceMount; Package Description: 2-Pin Surface Mount Device, Body 1.6 x 0.85 mm; Datasheet Version: 02/2017; Length: 1.6mm; Lead Free: LeadFree; Height: 0.45mm; Number of Terminations: 2; Max Power Dissipation: 100mW; Min Operating Temperature: -55degC; Datasheet URL: https://industrial.panasonic.com/cdbs/www-data/pdf/RDA0000/AOA0000C304.pdf; Termination: SMD/SMT; Case Code (Metric): 1608; Case Code (Imperial): 0603; Tolerance: 1%; Max Operating Temperature: 155degC; RoHSCompliant: true; Voltage Rating (DC): 75V; Radiation Hardening: No; Packaging: TapeandReel; Composition: ThickFilm; Mounting Technology: SurfaceMount; Manufacturer URL: http://www.panasonic.com/; Width: 0.031inch; REACH SVHC: NoSVHC; Contact Plating: Tin; Military Standard: Not; Package Quantity: 1
TP9-TP11 = CMP-00017-2
U5 = CMP-020-00023-2: M10 Gnss LGA Patch Antenna Mod; Min Supply Voltage: 1.8V; Max Supply Voltage: 3.3V; Case/Package: Custom

## Nets that join several sheets
3.3V: Teensy and ICs (14 pins), Power Management (R25.2 R33.1 R34.1), Communication (C9.1 C10.1 U5.2 U5.17)
5V: Teensy and ICs (20 pins), Power Management (R26.1 R30.2 TP5.1), Communication (R53.1 R63.1)
GND: Teensy and ICs (17 pins), Power Management (20 pins), Communication (21 pins)
CHARGE_STAT1: Teensy and ICs (U1.25), Power Management (R33.2 U4.3)
CHARGE_STAT2: Teensy and ICs (U1.26), Power Management (R34.2 U4.4)
CRX1: Teensy and ICs (U1.45), Communication (R48.1)
CTX1: Teensy and ICs (U1.44), Communication (R47.2)
GNSS_EXTINT: Teensy and ICs (U1.6), Communication (R11.2 TP10.1)
GNSS_RST: Teensy and ICs (U1.7), Communication (R10.1 TP11.1)
NetAv: Teensy and ICs (U1.28), Communication (R49.1)
OnOff_GATE: Teensy and ICs (SB11.1 U7.11), Communication (Q4.1)
PWR_SRC: Teensy and ICs (U1.27), Power Management (R25.1 TP7.1 U2.8)
RI: Teensy and ICs (U1.29), Communication (R50.1)
RX1: Teensy and ICs (U1.2), Communication (R40.1)
RX2: Teensy and ICs (U1.9), Communication (R46.1)
SCL0: Teensy and ICs (R1.1 R12.1 U1.41), Communication (R39.1)
SDA0: Teensy and ICs (R2.1 R14.1 U1.40), Communication (R41.1)
SOC: Teensy and ICs (U1.30), Power Management (R22.2 R23.1)
TX1: Teensy and ICs (U1.3), Communication (R42.1)
TX2: Teensy and ICs (U1.10), Communication (R51.1)

## Assembly variants
Production: not fitted J4 J8 J8 J? R1 R2 R3 R4 R5 R6 R8 R9 R19 R21 R36 R40 R41 R42 R42 R43 R45 R47 R47 R48 R48 R48 R49 R50 R52 R56 R? R? R? R? R? R? R? R? R? SW3